# EAGLE design v1 (EAGLE 8.5.0)
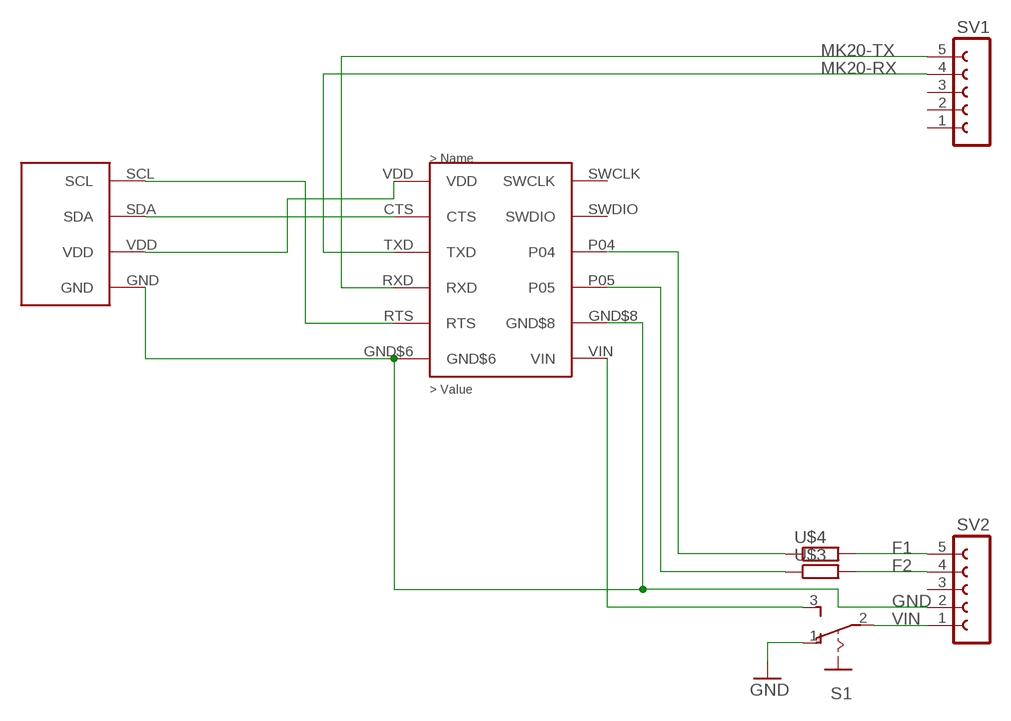
[diagram p0: schematic, sheet 1]

## Parts
9DOF-STICK  9D0F-STICK  [9DOF-STICK]
BLENANO-1.5  BLE-NANO-1.5  [BLE-NANO-1.5]
S1  M251  [M251]
SV1  FE05-1  [FE05-1]
SV2  FE05-1  [FE05-1]
U$3  RESISTOR_0201_N  [RESC0201_N]
U$4  RESISTOR_0201_N  [RESC0201_N]

## Nets
GND: S1.1(O)
N$1: BLENANO-1.5.VIN S1.3(S)
N$2: S1.2(P) SV2.1
N$3: 9DOF-STICK.GND BLENANO-1.5.GND$6 BLENANO-1.5.GND$8 SV2.2
N$4: SV2.4 U$3.2
N$5: SV2.5 U$4.2
N$6: BLENANO-1.5.P05 U$3.1
N$7: BLENANO-1.5.P04 U$4.1
N$8: BLENANO-1.5.TXD SV1.4
N$9: BLENANO-1.5.RXD SV1.5
N$10: 9DOF-STICK.SDA BLENANO-1.5.CTS
N$11: 9DOF-STICK.SCL BLENANO-1.5.RTS
N$12: 9DOF-STICK.VDD BLENANO-1.5.VDD
Unconnected: BLENANO-1.5.SWCLK BLENANO-1.5.SWDIO SV1.1 SV1.2 SV1.3 SV2.3

## Notes on the sheet
- MK20-TX
- MK20-RX
- F1
- F2
- GND
- VIN

## Library data of the parts
9DOF-STICK = tex-tronics:9D0F-STICK: SparkFun 9DoF Sensor Stick
BLENANO-1.5 = tex-tronics:BLE-NANO-1.5: BLE Nano v1.5
S1 = switch:M251: SLIDING SWITCH Mors, distributor Buerklin, 11G702
SV1 SV2 = con-lsta:FE05-1: FEMALE HEADER; OC_FARNELL: unknown; OC_NEWARK: unknown
U$3 U$4 = Nordic_misc:RESISTOR: Generic chip resistor

## Board
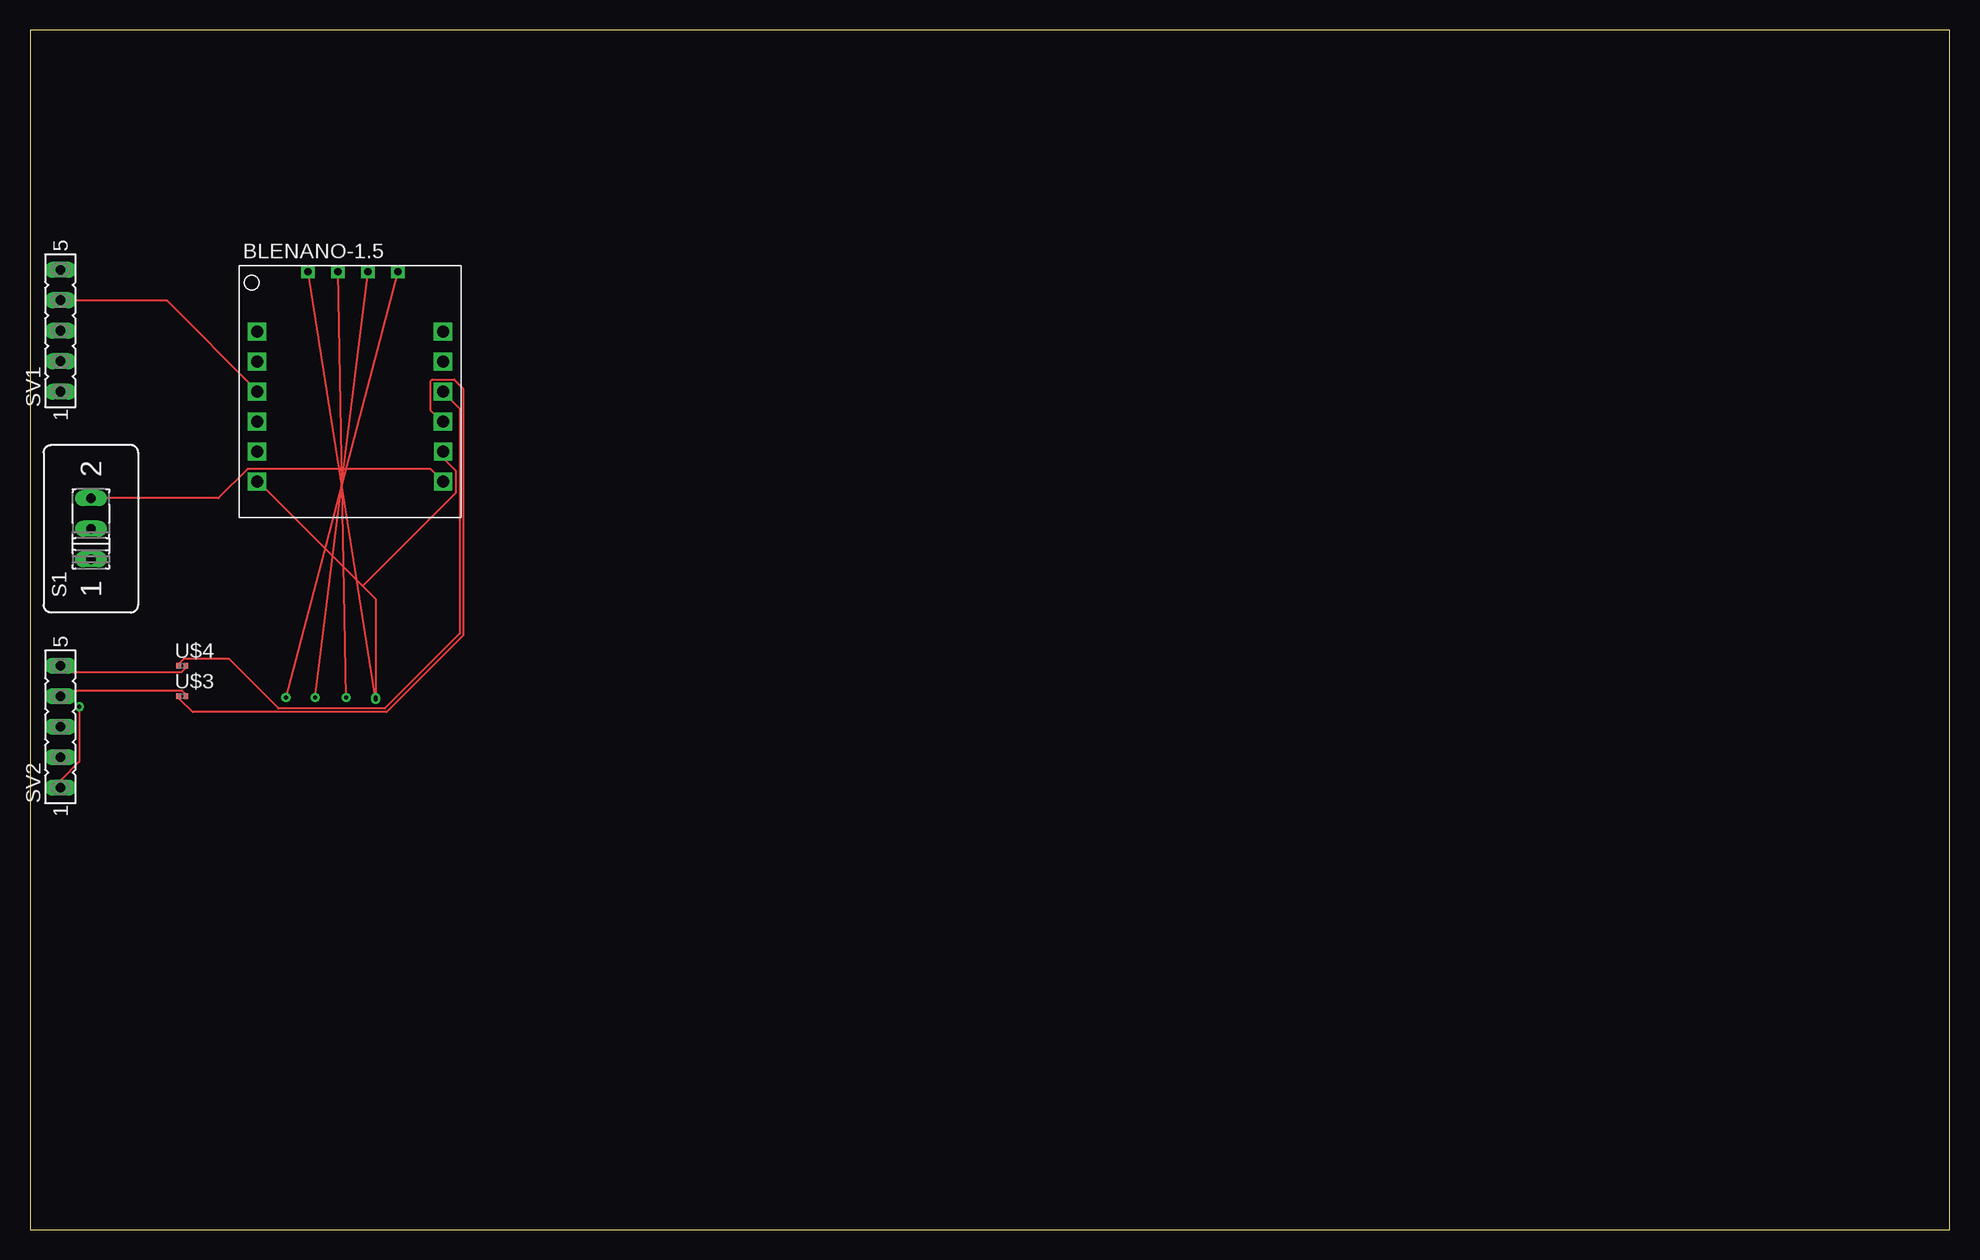
[diagram p1: board, top side]
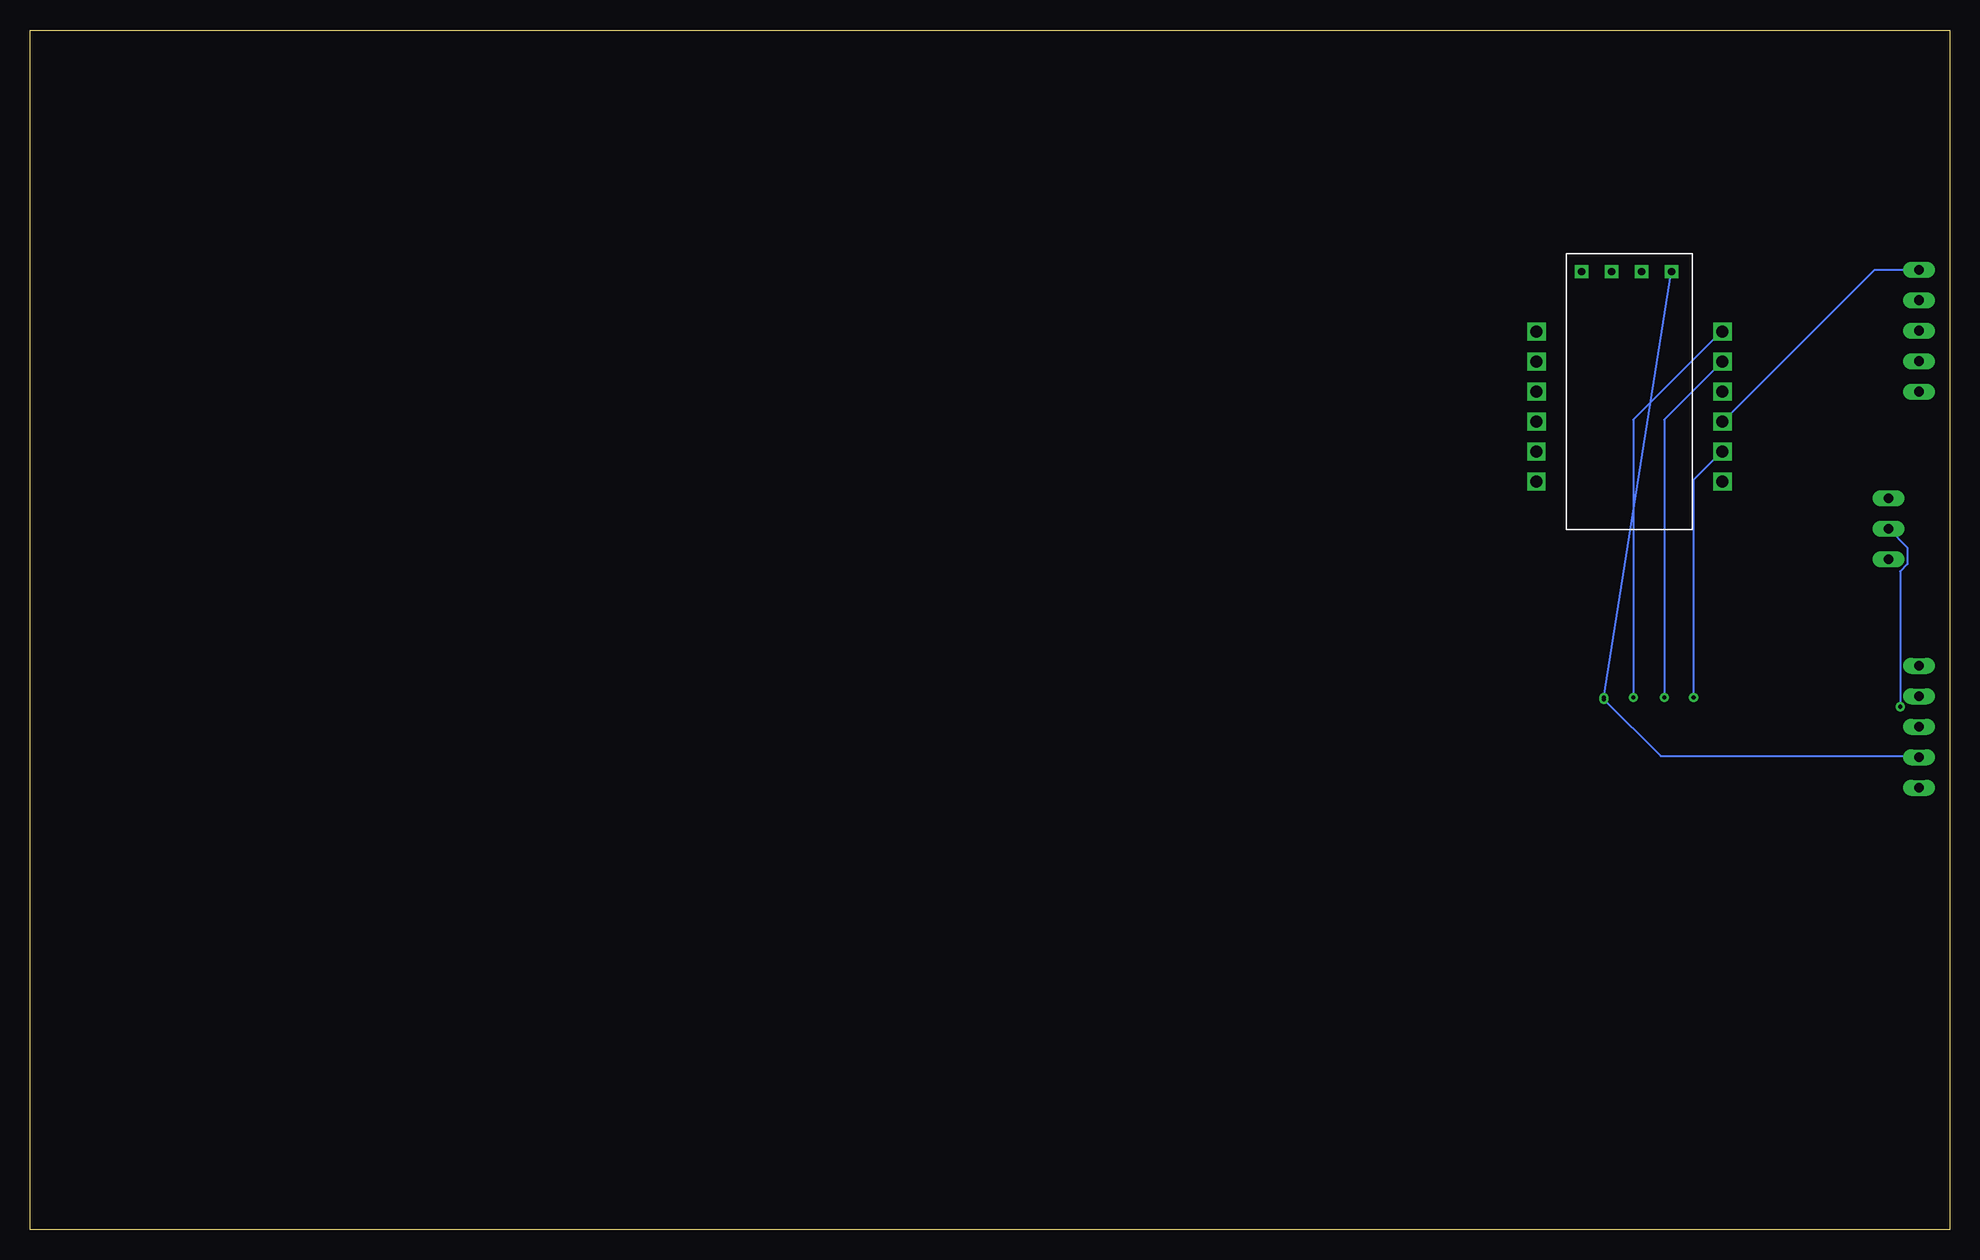
[diagram p2: board, bottom side, seen from below]

Size 160 x 100 mm. Coordinates in mm from the lower left corner, seen from the top.
Outline: 0,0 160,0 160,100 0,100 0,0
Copper layers (1*16): Top 0.035mm / dielectric 1.5mm / Bottom 0.035mm
Design rules "default": minimum track width 6mil, minimum drill 0.35mm, track to track 6mil, track to pad 6mil, pad to pad 6mil, via to via 6mil, smd to smd 6mil, copper to edge 40mil, drill to drill 6mil, minimum pad ring 10mil, minimum via ring 8mil, stop-mask expansion 4mil, vias tented up to drill 0mil, thermal gap 10mil

### Footprints (pad centres in the part's own frame; a part is rotated, then mirrored left to right if it is on the bottom)
9DOF-STICK = drill 0.6 square: GND -10,3.5; SCL -10,-4; SDA -10,-1.5; VDD -10,1
BLE-NANO-1.5 = drill 1 pad 1.016 square: CTS -7.75,2.5; GND$6 -7.75,-7.5; GND$8 7.76,-5; P04 7.75,0; P05 7.75,-2.5; RTS -7.75,-5; RXD -7.75,-2.5; SWCLK 7.75,5; SWDIO 7.75,2.5; TXD -7.75,0; VDD -7.75,5; VIN 7.76,-7.5
M251 = drill 0.813 long: 1 -2.54,0; 2 0,0; 3 2.54,0
FE05-1 = drill 0.813 long: 1 -5.08,0; 2 -2.54,0; 3 0,0; 4 2.54,0; 5 5.08,0
RESC0201_N = smd 0.4 x 0.45: 1 -0.305,0; 2 0.305,0

### Placement (x,y rotation side)
9DOF-STICK  26.67,69.85 270 bottom
BLENANO-1.5  26.67,69.85 0 top
S1  5.08,58.42 90 top
SV1  2.54,74.93 90 top
SV2  2.54,41.91 90 top
U$3  12.7,44.45 0 top
U$4  12.7,46.99 0 top

### Tracks (layer width: path | path; a pad name or v marks a point on that pad's centre or on a via)
N$1
  Top 0.152: S1.3 15.7,60.96 18.14,63.4 33.38,63.4 34.29,62.48 BLENANO-1.5.VIN
N$2  (via drill 0.35)
  Top 0.152: v4.12,43.59 4.12,39.01 2.59,37.49 2.59,36.88 SV2.1
  Bottom 0.152: v4.12,43.59 4.12,54.86 3.5,55.47 3.5,56.84 S1.2
N$3  (via drill 0.35)
  Top 0.152: v28.8,44.35 28.8,52.58 27.74,53.65 | 27.74,53.65 19.05,62.33 BLENANO-1.5.GND$6 | v28.8,44.2 9DOF-STICK.GND | 27.74,53.65 35.51,61.42 35.51,63.25 34.44,64.31 34.44,64.77 BLENANO-1.5.GND$8
  Bottom 0.152: v28.8,44.35 9DOF-STICK.GND | v28.8,44.2 24.08,39.47 2.59,39.47 SV2.2
N$4
  Top 0.152: SV2.4 3.05,44.96 12.65,44.96 12.95,44.65 12.95,44.5 U$3.2
N$5
  Top 0.152: SV2.5 3.05,46.48 12.65,46.48 12.95,46.79 12.95,46.94 U$4.2
N$6
  Top 0.152: U$3.1 12.5,44.35 12.5,44.2 13.56,43.13 29.72,43.13 36.12,49.53 36.12,70.1 35.36,70.87 33.53,70.87 33.38,70.71 33.38,68.28 34.29,67.36 BLENANO-1.5.P05
N$7
  Top 0.152: U$4.1 12.5,47.09 12.5,47.24 12.8,47.55 16.61,47.55 20.73,43.43 29.57,43.43 35.81,49.68 35.81,68.43 34.44,69.8 BLENANO-1.5.P04
N$8
  Top 0.152: SV1.4 2.59,77.42 11.43,77.42 18.9,69.95 BLENANO-1.5.TXD
N$9
  Bottom 0.152: SV1.5 6.25,80.01 18.9,67.36 BLENANO-1.5.RXD
N$10  (via drill 0.35)
  Top 0.152: v23.77,44.35 9DOF-STICK.SDA
  Bottom 0.152: v23.77,44.35 23.77,67.51 19.05,72.24 BLENANO-1.5.CTS
N$11  (via drill 0.35)
  Top 0.152: v21.34,44.35 9DOF-STICK.SCL
  Bottom 0.152: v21.34,44.35 21.34,62.48 19.05,64.77 BLENANO-1.5.RTS
N$12  (via drill 0.35)
  Top 0.152: v26.36,44.35 9DOF-STICK.VDD
  Bottom 0.152: v26.36,44.35 26.36,67.51 19.05,74.83 BLENANO-1.5.VDD